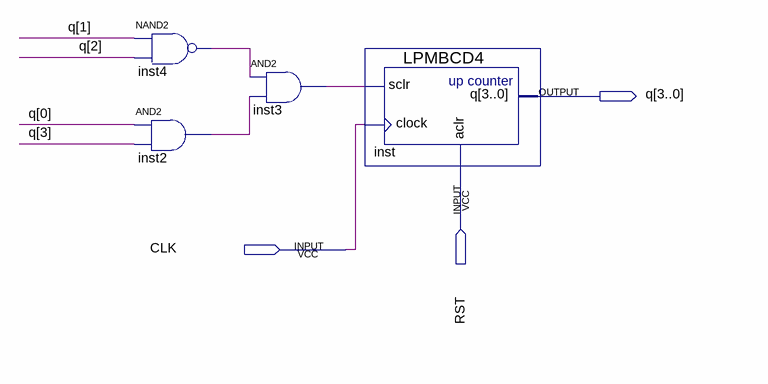
[diagram p0: schematic sheet]
// Quartus schematic lab503LPMCBD.bdf as structural Verilog: 4 symbols, 3 pins
module lab503LPMCBD (
  input  RST,
  input  CLK,
  output [3:0] q
);

  wire inst2_out, inst3_out, inst4_out;

  nand inst4 (inst4_out, q[1], q[2]);
  and inst2 (inst2_out, q[0], q[3]);
  and inst3 (inst3_out, inst4_out, inst2_out);
  LPMBCD4 inst (.sclr(inst3_out), .clock(CLK), .aclr(RST), .q(q));
endmodule
